# Altium schematic sheet CON_ADCDAC_SCRSTR10F.SchDoc: ADC / DAC Screw Header
size A4; Organization: Altium Limited.; Address1: Level 3, 12a Rodborough Rd; Address2: Frenchs Forest 2086; Address3: NSW; Address4: AUSTRALIA; Revision: 6; SheetNumber: 55; SheetTotal: 64
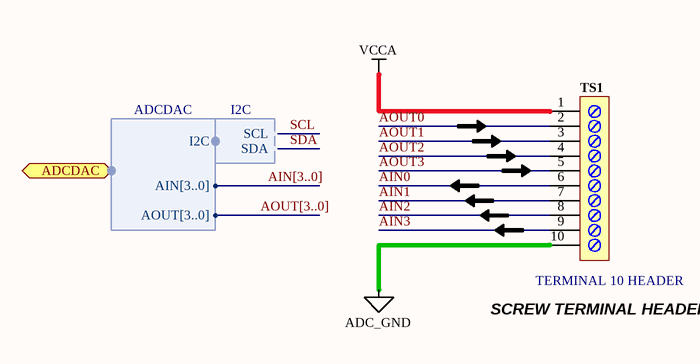
[diagram p0: CON_ADCDAC_SCRSTR10F.SchDoc]

## Parts
TS1  TERMINAL 10 HEADER  [TS2.54x10]

## Ports
ADCDAC (harness ADCDAC)

## Harnesses
ADCDAC: AIN[3..0], AOUT[3..0], I2C
I2C: SCL, SDA

## Nets
ADC_GND: TS1.10
VCCA: TS1.1
AIN0: TS1.6
AIN1: TS1.7
AIN2: TS1.8
AIN3: TS1.9
AOUT0: TS1.2
AOUT1: TS1.3
AOUT2: TS1.4
AOUT3: TS1.5
SCL: harness I2C.SCL
SDA: harness I2C.SDA

## Buses and harness runs
bus AIN[3..0]
bus AOUT[3..0]

## Notes on the sheet
- (near TS1) SCREW TERMINAL HEADER
- Sheet Title
- Project Title
- Size:
- Date:
- A4
- Assy:
- Time:
- Sheet
- Revision:
- of
- File:

## Library data of the parts
TS1 = D-300-0001: Connector, Screw Terminal Block, Green, 10-Way, 2.54mm; Category: Connector; Connector type: TERMINAL 10 HEADER; Status: Production